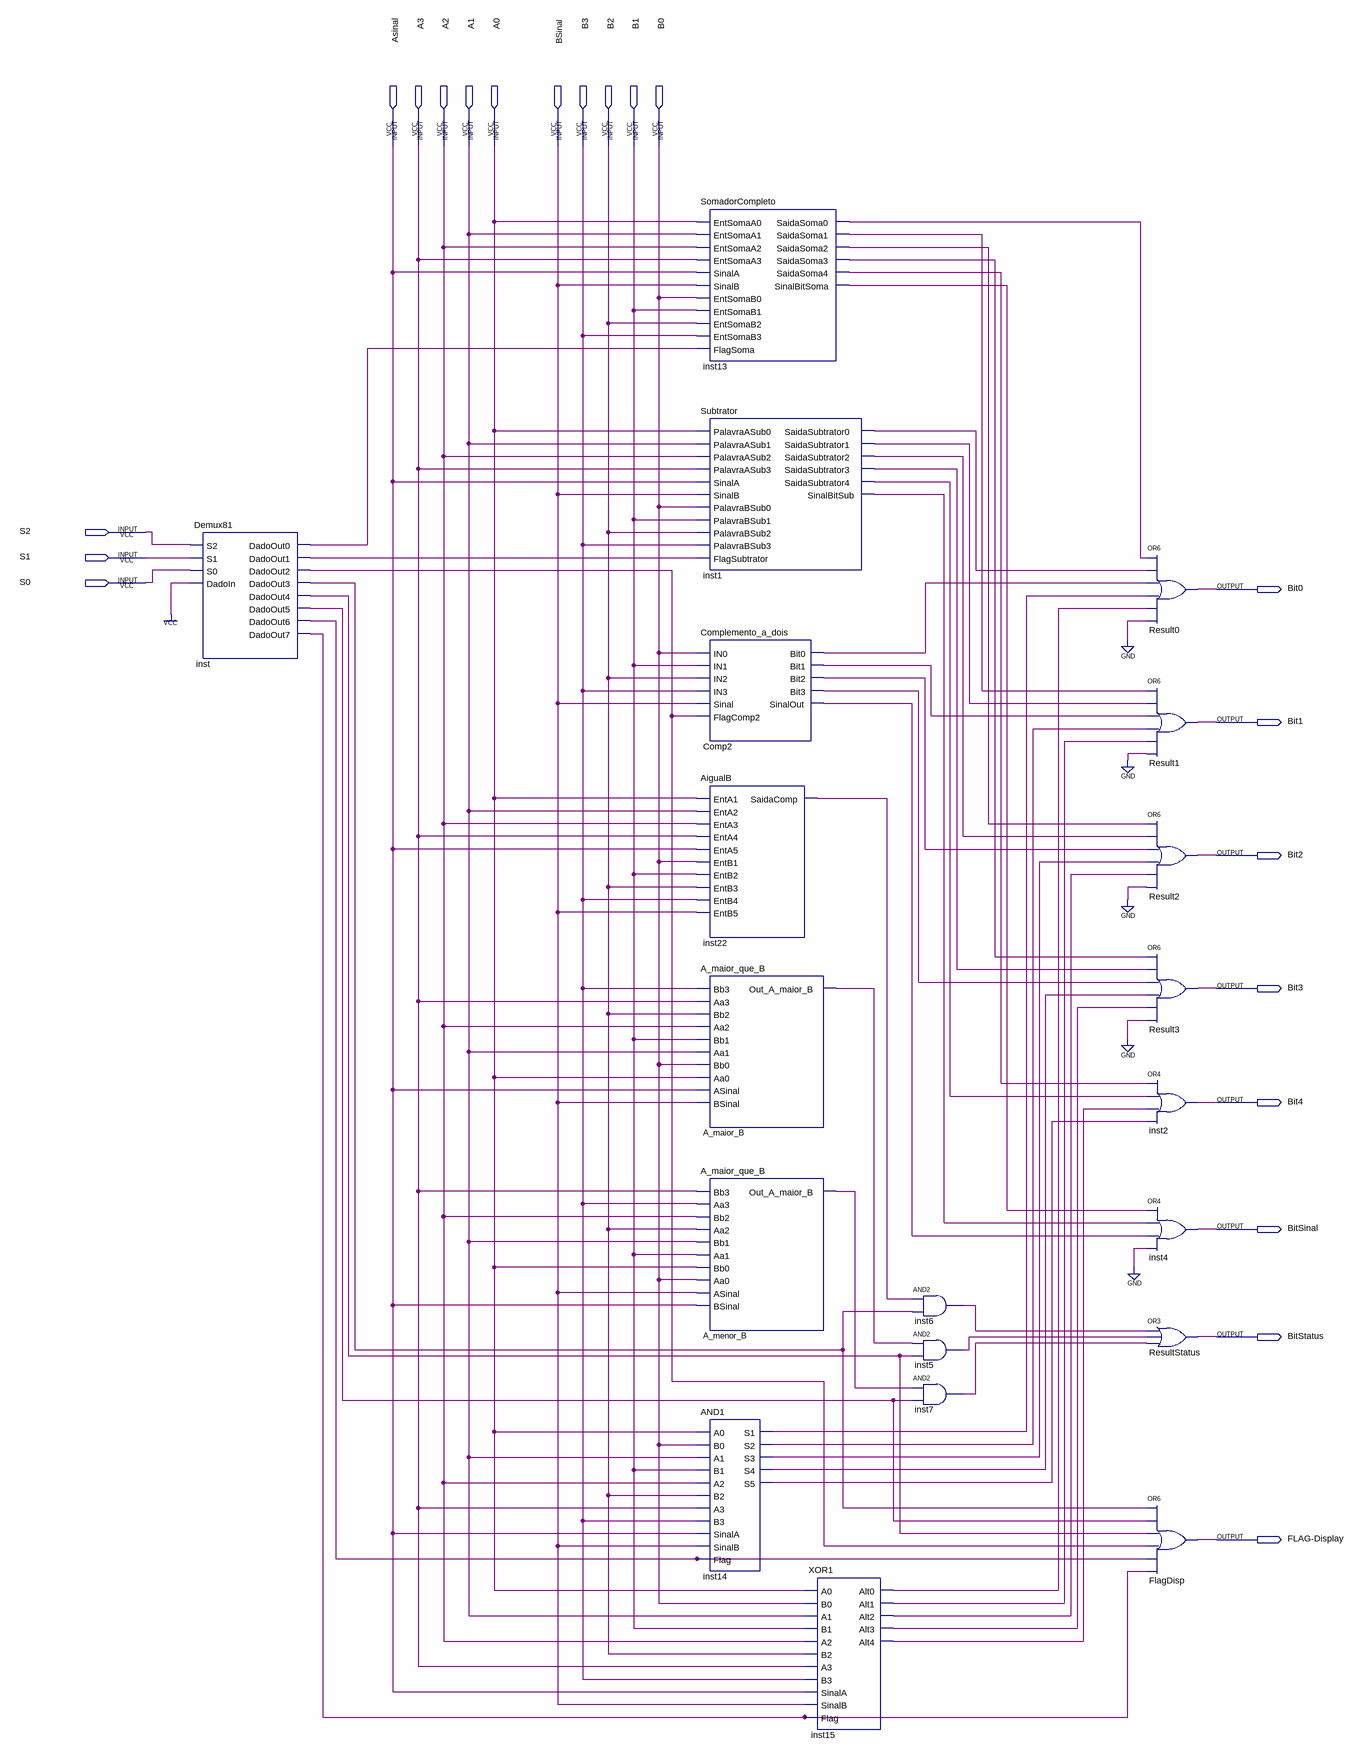
[diagram p0: schematic sheet]
// Quartus schematic ULA.bdf as structural Verilog: 20 symbols, 21 pins
module ULA (
  input  Asinal,
  input  A3,
  input  A2,
  input  A1,
  input  A0,
  input  BSinal,
  input  B3,
  input  B2,
  input  B1,
  input  B0,
  input  S2,
  input  S1,
  input  S0,
  output Bit0,
  output Bit1,
  output Bit2,
  output Bit3,
  output Bit4,
  output BitSinal,
  output BitStatus,
  output \FLAG-Display 
);

  wire A_maior_B_out_a_maior_b, A_menor_B_out_a_maior_b, Comp2_bit0, Comp2_bit1, Comp2_bit2, Comp2_bit3,
       Comp2_sinalout, inst1_saidasubtrator0, inst1_saidasubtrator1, inst1_saidasubtrator2,
       inst1_saidasubtrator3, inst1_saidasubtrator4, inst1_sinalbitsub, inst5_out, inst6_out, inst7_out,
       inst13_saidasoma0, inst13_saidasoma1, inst13_saidasoma2, inst13_saidasoma3, inst13_saidasoma4,
       inst13_sinalbitsoma, inst14_s1, inst14_s2, inst14_s3, inst14_s4, inst14_s5, inst15_alt0, inst15_alt1,
       inst15_alt2, inst15_alt3, inst15_alt4, inst22_saidacomp, inst_dadoout0, inst_dadoout1, inst_dadoout2,
       inst_dadoout3, inst_dadoout4, inst_dadoout5, inst_dadoout6, inst_dadoout7;

  Demux81 inst (
    .S2(S2), .S1(S1), .S0(S0), .DadoIn(1'b1), .DadoOut0(inst_dadoout0), .DadoOut1(inst_dadoout1),
    .DadoOut2(inst_dadoout2), .DadoOut3(inst_dadoout3), .DadoOut4(inst_dadoout4), .DadoOut5(inst_dadoout5),
    .DadoOut6(inst_dadoout6), .DadoOut7(inst_dadoout7));
  SomadorCompleto inst13 (
    .EntSomaA0(A0), .EntSomaA1(A1), .EntSomaA2(A2), .EntSomaA3(A3), .SinalA(Asinal), .SinalB(BSinal),
    .EntSomaB0(B0), .EntSomaB1(B1), .EntSomaB2(B2), .EntSomaB3(B3), .FlagSoma(inst_dadoout0),
    .SaidaSoma0(inst13_saidasoma0), .SaidaSoma1(inst13_saidasoma1), .SaidaSoma2(inst13_saidasoma2),
    .SaidaSoma3(inst13_saidasoma3), .SaidaSoma4(inst13_saidasoma4), .SinalBitSoma(inst13_sinalbitsoma));
  Subtrator inst1 (
    .PalavraASub0(A0), .PalavraASub1(A1), .PalavraASub2(A2), .PalavraASub3(A3), .SinalA(Asinal),
    .SinalB(BSinal), .PalavraBSub0(B0), .PalavraBSub1(B1), .PalavraBSub2(B2), .PalavraBSub3(B3),
    .FlagSubtrator(inst_dadoout1), .SaidaSubtrator0(inst1_saidasubtrator0),
    .SaidaSubtrator1(inst1_saidasubtrator1), .SaidaSubtrator2(inst1_saidasubtrator2),
    .SaidaSubtrator3(inst1_saidasubtrator3), .SaidaSubtrator4(inst1_saidasubtrator4),
    .SinalBitSub(inst1_sinalbitsub));
  Complemento_a_dois Comp2 (
    .IN0(B0), .IN1(B1), .IN2(B2), .IN3(B3), .Sinal(BSinal), .FlagComp2(inst_dadoout2), .Bit0(Comp2_bit0),
    .Bit1(Comp2_bit1), .Bit2(Comp2_bit2), .Bit3(Comp2_bit3), .SinalOut(Comp2_sinalout));
  AigualB inst22 (
    .EntA1(A0), .EntA2(A1), .EntA3(A2), .EntA4(A3), .EntA5(Asinal), .EntB1(B0), .EntB2(B1), .EntB3(B2),
    .EntB4(B3), .EntB5(BSinal), .SaidaComp(inst22_saidacomp));
  A_maior_que_B A_maior_B (
    .Bb3(B3), .Aa3(A3), .Bb2(B2), .Aa2(A2), .Bb1(B1), .Aa1(A1), .Bb0(B0), .Aa0(A0), .ASinal(Asinal),
    .BSinal(BSinal), .Out_A_maior_B(A_maior_B_out_a_maior_b));
  A_maior_que_B A_menor_B (
    .Bb3(A3), .Aa3(B3), .Bb2(A2), .Aa2(B2), .Bb1(A1), .Aa1(B1), .Bb0(A0), .Aa0(B0), .ASinal(BSinal),
    .BSinal(Asinal), .Out_A_maior_B(A_menor_B_out_a_maior_b));
  AND1 inst14 (
    .A0(A0), .B0(B0), .A1(A1), .B1(B1), .A2(A2), .B2(B2), .A3(A3), .B3(B3), .SinalA(Asinal), .SinalB(BSinal),
    .Flag(inst_dadoout6), .S1(inst14_s1), .S2(inst14_s2), .S3(inst14_s3), .S4(inst14_s4), .S5(inst14_s5));
  XOR1 inst15 (
    .A0(A0), .B0(B0), .A1(A1), .B1(B1), .A2(A2), .B2(B2), .A3(A3), .B3(B3), .SinalA(Asinal), .SinalB(BSinal),
    .Flag(inst_dadoout7), .Alt0(inst15_alt0), .Alt1(inst15_alt1), .Alt2(inst15_alt2), .Alt3(inst15_alt3),
    .Alt4(inst15_alt4));
  and inst6 (inst6_out, inst22_saidacomp, inst_dadoout3);
  and inst5 (inst5_out, A_maior_B_out_a_maior_b, inst_dadoout4);
  and inst7 (inst7_out, A_menor_B_out_a_maior_b, inst_dadoout5);
  or Result0 (Bit0, inst13_saidasoma0, inst1_saidasubtrator0, Comp2_bit0, inst14_s1, inst15_alt0, 1'b0);
  or Result1 (Bit1, inst13_saidasoma1, inst1_saidasubtrator1, Comp2_bit1, inst14_s2, inst15_alt1, 1'b0);
  or Result2 (Bit2, inst13_saidasoma2, inst1_saidasubtrator2, Comp2_bit2, inst14_s3, inst15_alt2, 1'b0);
  or Result3 (Bit3, inst13_saidasoma3, inst1_saidasubtrator3, Comp2_bit3, inst14_s4, inst15_alt3, 1'b0);
  or inst2 (Bit4, inst13_saidasoma4, inst1_saidasubtrator4, inst15_alt4, inst14_s5);
  or inst4 (BitSinal, inst13_sinalbitsoma, inst1_sinalbitsub, Comp2_sinalout, 1'b0);
  or ResultStatus (BitStatus, inst6_out, inst5_out, inst7_out);
  or FlagDisp (\FLAG-Display , inst_dadoout3, inst_dadoout5, inst_dadoout4, inst_dadoout2, inst_dadoout6, inst_dadoout7);
endmodule
